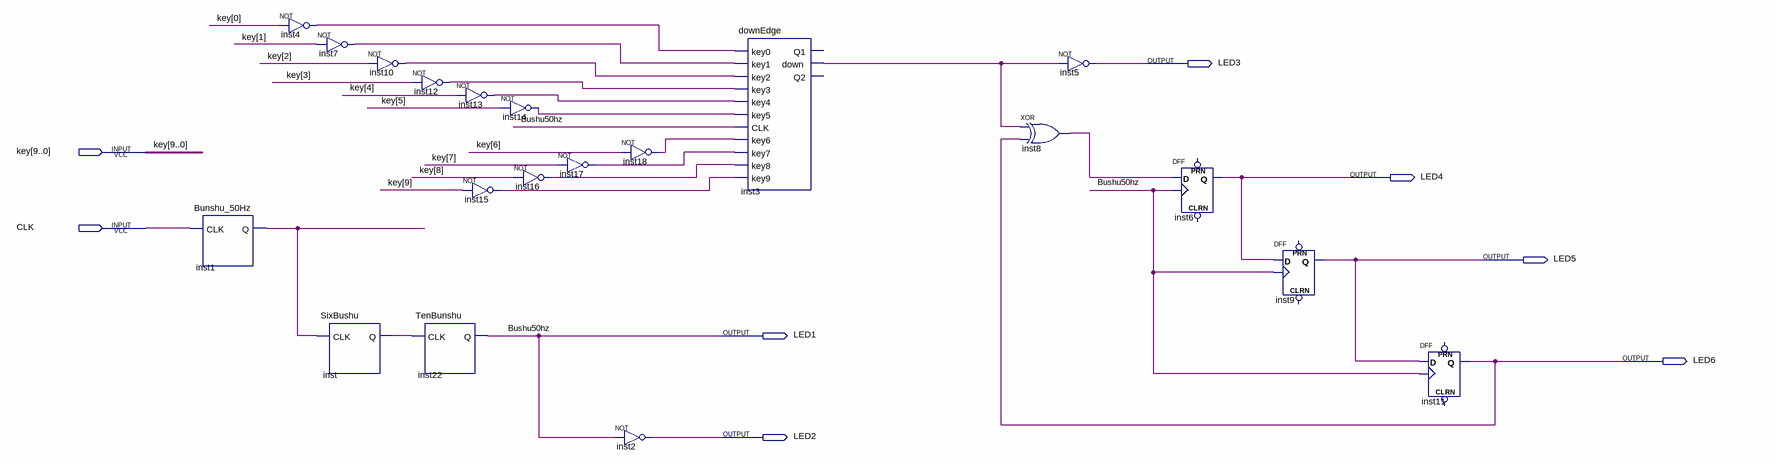
[diagram p0: schematic sheet]
// Quartus schematic kadai4kensho.bdf as structural Verilog: 20 symbols, 8 pins
module kadai4kensho (
  input  [9:0] key,
  input  CLK,
  output LED3,
  output LED4,
  output LED5,
  output LED1,
  output LED6,
  output LED2
);

  wire inst1_q, inst3_down, inst4_out, inst7_out, inst8_out, inst10_out, inst12_out, inst13_out, inst14_out,
       inst15_out, inst16_out, inst17_out, inst18_out, inst_q;

  Bunshu_50Hz inst1 (.CLK(CLK), .Q(inst1_q));
  not inst4 (inst4_out, key[0]);
  not inst7 (inst7_out, key[1]);
  SixBushu inst (.CLK(inst1_q), .Q(inst_q));
  not inst10 (inst10_out, key[2]);
  not inst12 (inst12_out, key[3]);
  TenBunshu inst22 (.CLK(inst_q), .Q(LED1));
  not inst13 (inst13_out, key[4]);
  not inst15 (inst15_out, key[9]);
  not inst14 (inst14_out, key[5]);
  not inst16 (inst16_out, key[8]);
  not inst17 (inst17_out, key[7]);
  not inst18 (inst18_out, key[6]);
  not inst2 (LED2, LED1);
  downEdge inst3 (
    .key0(inst4_out), .key1(inst7_out), .key2(inst10_out), .key3(inst12_out), .key4(inst13_out),
    .key5(inst14_out), .CLK(LED1), .key6(inst18_out), .key7(inst17_out), .key8(inst16_out),
    .key9(inst15_out), .down(inst3_down));  // open: Q1, Q2
  xor inst8 (inst8_out, inst3_down, LED6);
  not inst5 (LED3, inst3_down);
  DFF inst6 (.CLK(LED1), .D(inst8_out), .Q(LED4));  // open: CLRN, PRN
  DFF inst9 (.CLK(LED1), .D(LED4), .Q(LED5));  // open: CLRN, PRN
  DFF inst11 (.CLK(LED1), .D(LED5), .Q(LED6));  // open: CLRN, PRN

  // Other names for the same wires on the sheet: Bushu50hz = LED1
endmodule
